# Altium project SensorBoard.PrjPcb
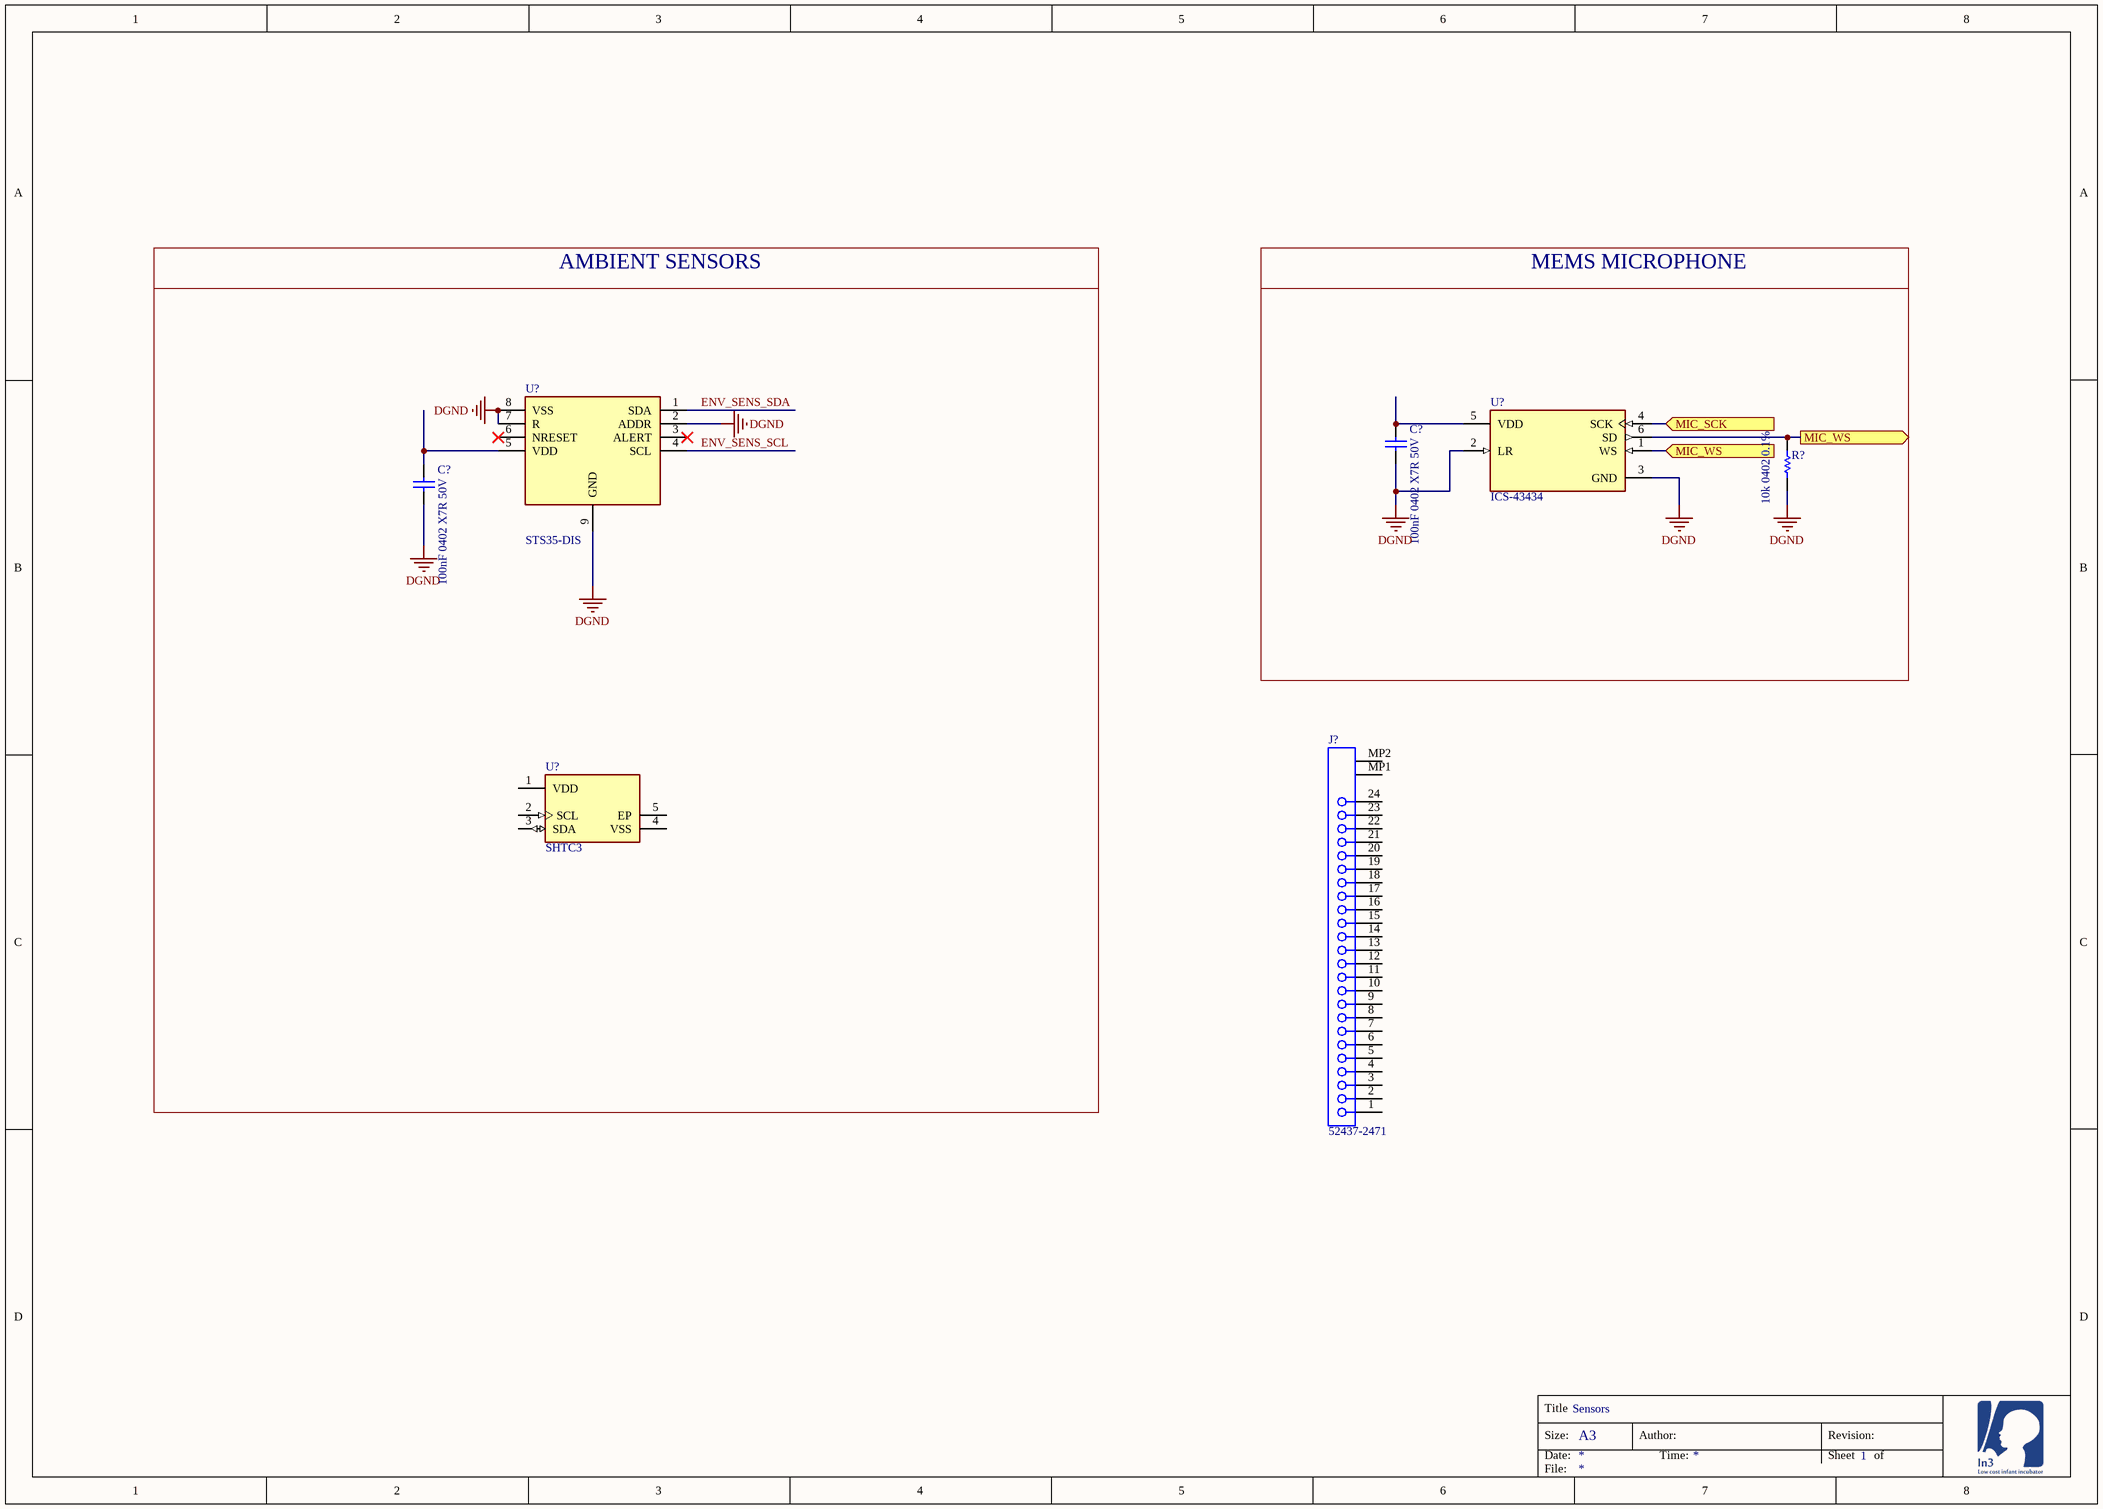
[diagram p0: Camera.SchDoc]
1 sheet, 7 parts. Net scope: flat (ports and power ports of the same name join across sheets).
Board file: SensorBoard.PcbDoc

## Sheet Camera.SchDoc: Sensors
size A3; SheetNumber: 1; SheetTotal: 5

### Parts
(Parts that share a designator on the sheet are numbered #1, #2 ... from top to bottom, then left to right.)
C?#1  100nF 0402 X7R 50V  [CAPC1005X55X25NL5T10]
C?#2  100nF 0402 X7R 50V  [CAPC1005X55X25NL5T10]
J?  52437-2471  [MOLX-52437-2471]
R?  10k 0402 0.1%  [RESC1005X40X25ML05T10]
U?#1  STS35-DIS  [SON50P250X250X100-9N-D]
U?#2  ICS-43434  [FP-ICS-43434-MFG]
U?#3  SHTC3  [FP-SHTC3-MFG]

### Blocks framed on the sheet
AMBIENT SENSORS: C?#2 U?#1 U?#3
MEMS MICROPHONE: C?#1 R? U?#2

### Ports
MIC_SCK (in), MIC_WS (in), MIC_WS (out)

### Nets
DGND: C?#1.1 C?#2.1 R?.1 U?#1.2(ADDR) U?#1.7(R) U?#1.8(VSS) U?#1.9(GND) U?#2.2(LR) U?#2.3(GND)
ENV_SENS_SCL: U?#1.4(SCL)
ENV_SENS_SDA: U?#1.1(SDA)
NetC?#1_2: C?#1.2 U?#2.5(VDD)
NetC?#2_2: C?#2.2 U?#1.5(VDD)
NetR?_2: R?.2 U?#2.1(WS) U?#2.6(SD) ; port MIC_WS
NetU?#2_4: U?#2.4(SCK) ; port MIC_SCK

Not connected (* = marked no-connect by the designer): J? 1 2 3 4 5 6 7 8 9 10 11 12 13 14 15 16 17 18 19 20 21 22 23 24 MP1 MP2; U?#1 3(ALERT)* 6(NRESET)*; U?#3 1(VDD) 2(SCL) 3(SDA) 4(VSS) 5(EP)

### Notes on the sheet
- Title
- Size:
- Date:
- A3
- Author:
- Time:
- Revision:
- Sheet
- of
- File:

### Library data of the parts
C?#1 C?#2 = CMP-1662-00020-1: ComponentLink2Description: Datasheet; ComponentLink2URL: http://psearch.en.murata.com/capacitor/product/GRM155R60J105KE19%23.pdf; ComponentLink1Description: Manufacturer URL; ComponentLink1URL: http://www.murata.com/; LCSC_PN: C77020
J? = CMP-1241-00285-1: 0.5 mm Pitch Easy-On(TM) Type FPC Connector, Right Angle, ZIF, SMT, Bottom Contact, 24 Circuits, -40 to 85 degC, ELV and RoHS Compliant, Tape and Reel; Manufacturer: Molex; Material - Metal: Phosphor Bronze; Material - Plating Mating: Gold; Durability (mating cycles max): 20; Stackable: No; Entry Angle: 90degrees Angle; Circuits (Loaded): 24; Current (Max per Contact): 0.5A; PCB Retention: None; Pitch - Mating Interface: 0.50mm; Polarized to PCB: Yes; Voltage (Max): 50V; ComponentLink2URL: http://www.molex.com/webdocs/datasheets/pdf/en-us/0524372471_FFC_FPC_CONNECTORS.pdf; ComponentLink1URL: http://www.molex.com/molex/index.jsp; Mounting Technology: Surface Mount; RoHS: TRUE; PartNumber: 52437-2471; ComponentLink3Description: Package Specification; ComponentLink2Description: Datasheet; PackageReference: 52437-2471; Contact Position: Bottom; ComponentLink3URL: http://www.molex.com/pdm_docs/sd/524372471_sd.pdf; ComponentLink1Description: Manufacturer URL; PackageVersion: Rev. E, 07/2013; Number of Rows: 1; PCB Locator: No; Packing: Tape and Reel; PackageDescription: 24-Lead FPC Connector, Pitch 0.5 mm; Material - Plating Termination: Gold; Orientation: Right Angle
R? = CMP-2002-07472-1: LCSC_PN: C190095
U?#1 = STS35-DIS: Integrated Circuit; Manufacturer_Name: Sensirion; Datasheet Link: https://componentsearchengine.com/Datasheets/1/STS35-DIS.pdf; Height: 1mm; Manufacturer_Part_Number: STS35-DIS; Mouser Part Number: 403-STS35-DIS; Mouser Price/Stock: https://www.mouser.co.uk/ProductDetail/Sensirion/STS35-DIS?qs=F5EMLAvA7IBgq10iVaCNnw%3D%3D; LCSC_PN: C5439927
U?#2 = CMP-03292-71346757-1: ICS-43434 Mic Omni-Directional -26dB 3.63V Rectangular Solder Pad T/R; Min Supply Voltage: 1.65V; Direction: Omnidirectional; Operating Supply Current: 550µA; Output Type: Digital; Max Operating Temperature: 85°C; Max Length: 3.6mm; NexarPartId: 71346757; RoHS: Compliant; Width: 2.65mm; Min Operating Temperature: -40°C; Max Supply Voltage: 3.63V; Min Length: 3.4mm; Length: 3.5mm; Min Thickness: 880µm; Lifecycle Status: Production; Min Width: 2.55mm; Max Thickness: 1.08mm; Max Width: 2.75mm; Schedule B: 8518100000; Height: 980µm
U?#3 = CMP-144040-000003-1: SENSOR HUMI/TEMP I2C 2% SMD; Manufacturer: Sensirion; Operating Supply Current: 0.3-900uA; Resolution: 16bits; Description: Humidity Temperature Sensor 0 ~ 100% RH I²C ±2% RH 8s Surface Mount; Min Supply Voltage: 1.62V; Max Supply Voltage: 3.6V; Category: IC; Device Class L3: unset; ComponentLink2URL: https://www.sensirion.com/fileadmin/user_upload/customers/sensirion/Dokumente/0_Datasheets/Humidity/Sensirion_Humidity_Sensors_SHTC3_Datasheet.pdf; Ipc Land Pattern Name: DFN200X200X75-4; RoHS: TRUE; Height: 0.75mm; Interface: I2C; Temperature Range High: +125°C; Accuracy: 2%; Sensor Output: I2C; Automotive: No; Package: 0; Device Class L1: Sensors; Manufacturer Part Number: SHTC3; Digikey Description: SENSOR HUMI/TEMP I2C 2% SMD; Lead Free: Yes; Temperature: -40°C to +125°C; Device Class L2: Temperature and Humidity Sensors; ComponentLink2Description: Datasheet; Octopart: https://octopart.com/shtc3-sensirion-91912225; Mouser Description: SHTC3 Series 0 to 100% RH 3.6 V Humidity and Temperature Sensor IC - DFN-4; Temperature Range Low: -40°C